# Altium schematic sheet BlockView.SchDoc
size C
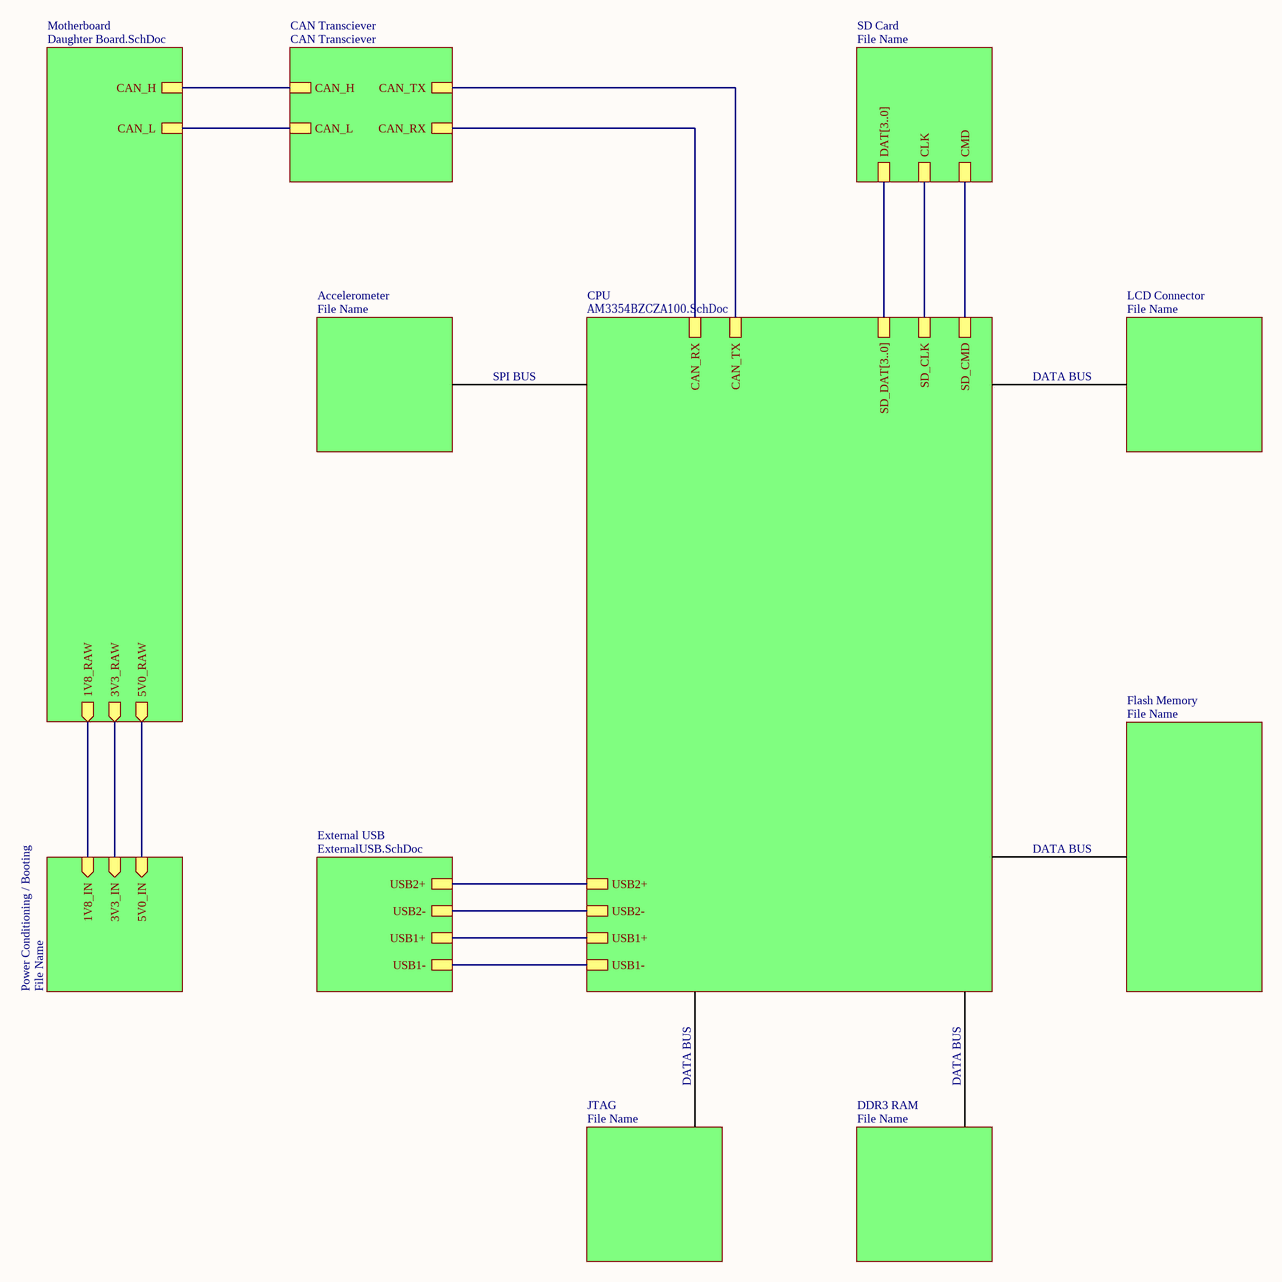
[diagram p0: BlockView.SchDoc]

## Sub-sheets
Accelerometer = File Name: no entries
CAN Transciever = CAN Transciever: CAN_H, CAN_L, CAN_TX, CAN_RX
CPU = AM3354BZCZA100​.SchDoc: USB2+, USB2-, CAN_TX, CAN_RX, SD_DAT[3..0], SD_CLK, SD_CMD, USB1+, USB1-
DDR3 RAM = File Name: no entries
External USB = ExternalUSB.SchDoc: USB2+, USB2-, USB1+, USB1-
Flash Memory = File Name: no entries
JTAG = File Name: no entries
LCD Connector = File Name: no entries
Motherboard = Daughter Board.SchDoc: CAN_H, CAN_L, 1V8_RAW (out), 5V0_RAW (out), 3V3_RAW (out)
Power Conditioning / Booting = File Name: 1V8_IN (in), 3V3_IN (in), 5V0_IN (in)
SD Card = File Name: DAT[3..0], CLK, CMD

## Nets
(unnamed): sheet Motherboard/CAN_H, sheet CAN Transciever/CAN_H
(unnamed): sheet Motherboard/CAN_L, sheet CAN Transciever/CAN_L
(unnamed): sheet Motherboard/1V8_RAW, sheet Power Conditioning / Booting/1V8_IN
(unnamed): sheet Motherboard/5V0_RAW, sheet Power Conditioning / Booting/5V0_IN
(unnamed): sheet Motherboard/3V3_RAW, sheet Power Conditioning / Booting/3V3_IN
(unnamed): sheet CPU/USB2+, sheet External USB/USB2+
(unnamed): sheet CPU/USB2-, sheet External USB/USB2-
(unnamed): sheet CPU/CAN_TX, sheet CAN Transciever/CAN_TX
(unnamed): sheet CPU/CAN_RX, sheet CAN Transciever/CAN_RX
(unnamed): sheet CPU/SD_DAT[3..0], sheet SD Card/DAT[3..0]
(unnamed): sheet CPU/SD_CLK, sheet SD Card/CLK
(unnamed): sheet CPU/SD_CMD, sheet SD Card/CMD
(unnamed): sheet CPU/USB1+, sheet External USB/USB1+
(unnamed): sheet CPU/USB1-, sheet External USB/USB1-

## Notes on the sheet
- SPI BUS
- DATA BUS